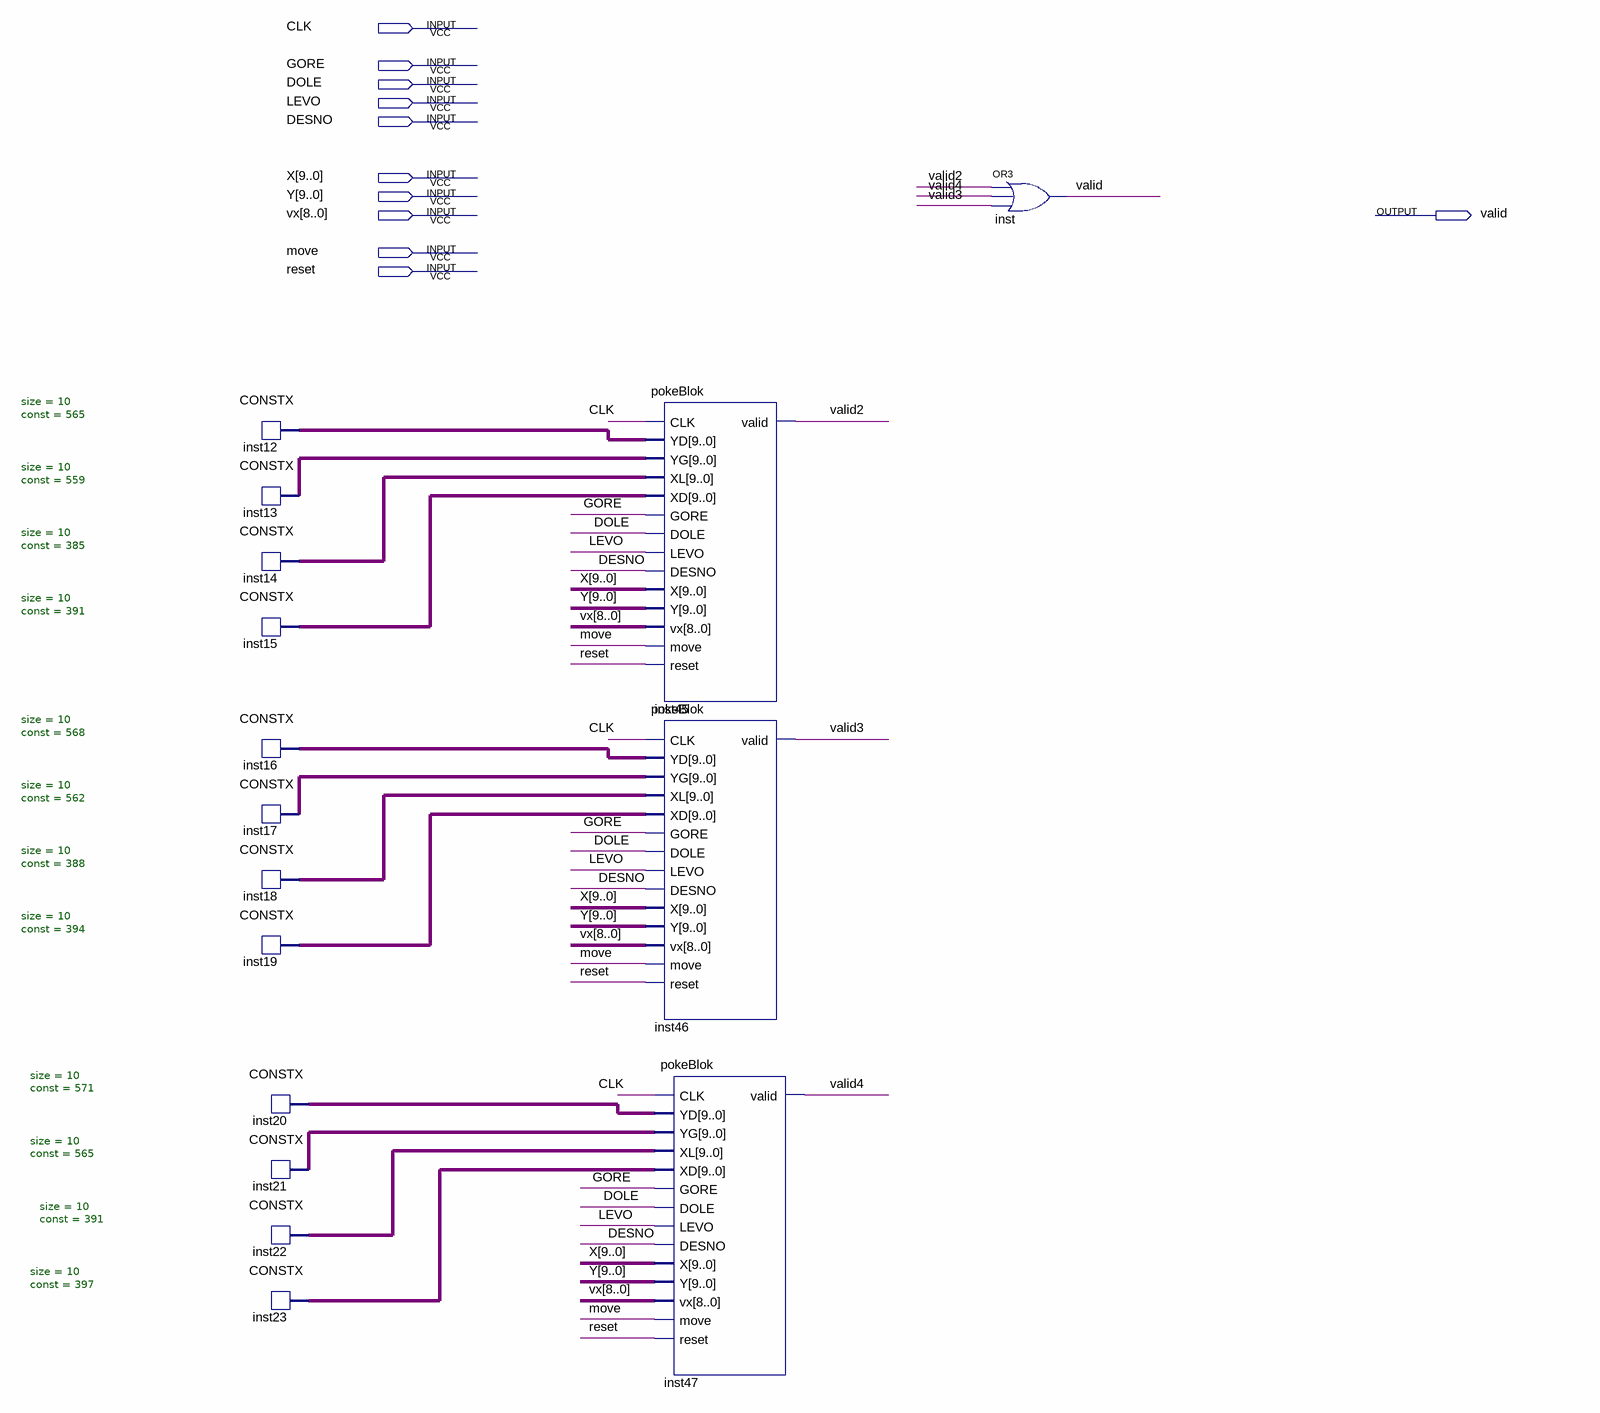
[diagram p0: schematic sheet]
// Quartus schematic zutiPokeStomak.bdf as structural Verilog: 16 symbols, 11 pins
module zutiPokeStomak (
  input  CLK,
  input  GORE,
  input  DOLE,
  input  LEVO,
  input  DESNO,
  input  [9:0] X,
  input  [9:0] Y,
  input  [8:0] vx,
  input  move,
  input  reset,
  output valid
);

  wire valid2, valid3, valid4;
  wire [9:0] inst12_data, inst13_data, inst14_data, inst15_data, inst16_data, inst17_data, inst18_data,
       inst19_data, inst20_data, inst21_data, inst22_data, inst23_data;

  CONSTX #(.size(10), .\const (565)) inst12 (.data(inst12_data));
  CONSTX #(.size(10), .\const (559)) inst13 (.data(inst13_data));
  CONSTX #(.size(10), .\const (385)) inst14 (.data(inst14_data));
  CONSTX #(.size(10), .\const (391)) inst15 (.data(inst15_data));
  CONSTX #(.size(10), .\const (568)) inst16 (.data(inst16_data));
  CONSTX #(.size(10), .\const (562)) inst17 (.data(inst17_data));
  CONSTX #(.size(10), .\const (388)) inst18 (.data(inst18_data));
  CONSTX #(.size(10), .\const (394)) inst19 (.data(inst19_data));
  CONSTX #(.size(10), .\const (571)) inst20 (.data(inst20_data));
  CONSTX #(.size(10), .\const (565)) inst21 (.data(inst21_data));
  CONSTX #(.size(10), .\const (391)) inst22 (.data(inst22_data));
  CONSTX #(.size(10), .\const (397)) inst23 (.data(inst23_data));
  pokeBlok inst45 (
    .CLK(CLK), .YD(inst12_data), .YG(inst13_data), .XL(inst14_data), .XD(inst15_data), .GORE(GORE),
    .DOLE(DOLE), .LEVO(LEVO), .DESNO(DESNO), .X(X), .Y(Y), .vx(vx), .move(move), .reset(reset), .valid(valid2));
  pokeBlok inst46 (
    .CLK(CLK), .YD(inst16_data), .YG(inst17_data), .XL(inst18_data), .XD(inst19_data), .GORE(GORE),
    .DOLE(DOLE), .LEVO(LEVO), .DESNO(DESNO), .X(X), .Y(Y), .vx(vx), .move(move), .reset(reset), .valid(valid3));
  pokeBlok inst47 (
    .CLK(CLK), .YD(inst20_data), .YG(inst21_data), .XL(inst22_data), .XD(inst23_data), .GORE(GORE),
    .DOLE(DOLE), .LEVO(LEVO), .DESNO(DESNO), .X(X), .Y(Y), .vx(vx), .move(move), .reset(reset), .valid(valid4));
  or inst (valid, valid2, valid4, valid3);
endmodule
